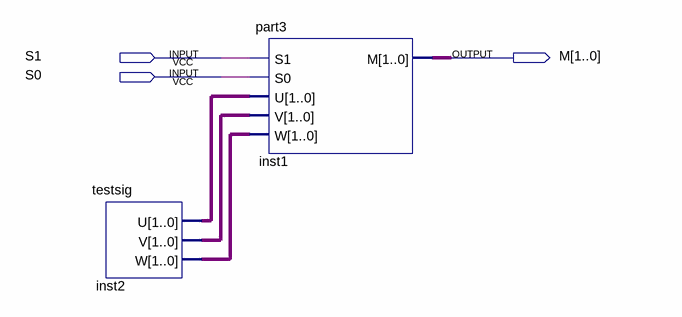
[diagram p0: schematic sheet]
// Quartus schematic part3test.bdf as structural Verilog: 2 symbols, 3 pins
module part3test (
  input  S1,
  input  S0,
  output [1:0] M
);

  wire [1:0] inst2_u, inst2_v, inst2_w;

  testsig inst2 (.U(inst2_u), .V(inst2_v), .W(inst2_w));
  part3 inst1 (.S1(S1), .S0(S0), .U(inst2_u), .V(inst2_v), .W(inst2_w), .M(M));
endmodule
